# EAGLE design audio_proc (EAGLE 5.07)
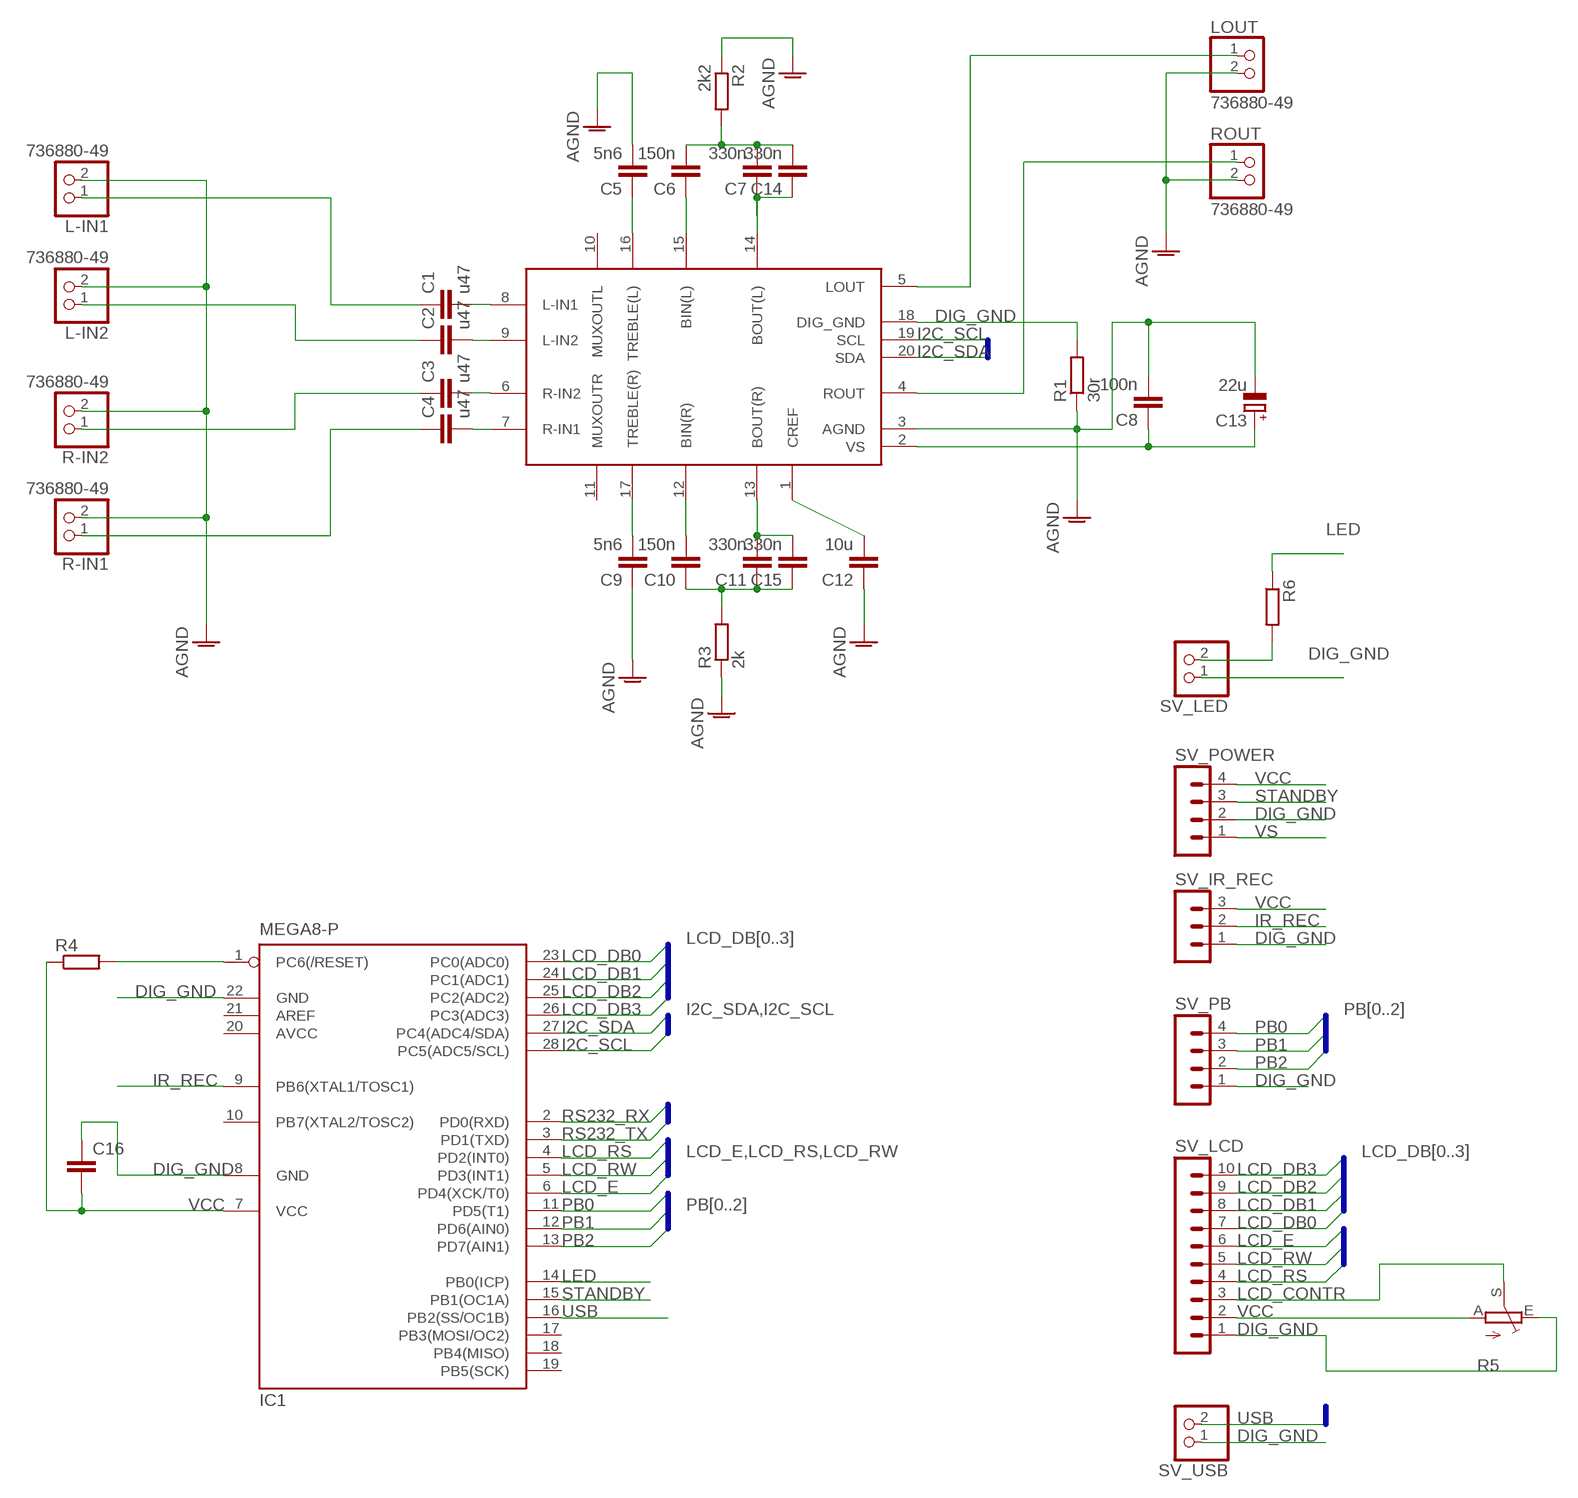
[diagram p0: schematic, sheet 1]

## Parts
C1  u47  C-EU050-030X075  [C050-030X075]
C2  u47  C-EU050-030X075  [C050-030X075]
C3  u47  C-EU050-030X075  [C050-030X075]
C4  u47  C-EU050-030X075  [C050-030X075]
C5  5n6  C-EU050-030X075  [C050-030X075]
C6  150n  C-EU050-030X075  [C050-030X075]
C7  330n  C-EU050-030X075  [C050-030X075]
C8  100n  C-EU025-025X050  [C025-025X050]
C9  5n6  C-EU050-030X075  [C050-030X075]
C10  150n  C-EU050-030X075  [C050-030X075]
C11  330n  C-EU050-030X075  [C050-030X075]
C12  10u  C-EU050-030X075  [C050-030X075]
C13  22u  CPOL-EUE2.5-6  [E2,5-6]
C14  330n  C-EU050-030X075  [C050-030X075]
C15  330n  C-EU050-030X075  [C050-030X075]
C16  C-EU025-024X044  [C025-024X044]
IC1  MEGA8-P  [DIL28-3]
L-IN1  736880-49  PINHD-1X2  [1X02]
L-IN2  736880-49  PINHD-1X2  [1X02]
LOUT  736880-49  PINHD-1X2  [1X02]
R1  30r  R-EU_0204/5  [0204/5]
R2  2k2  R-EU_0204/2V  [0204V]
R3  2k  R-EU_0204/2V  [0204V]
R4  R-EU_0204/2V  [0204V]
R5  TRIM_EU-S75P  [S75P]
R6  R-EU_0204/5  [0204/5]
R-IN1  736880-49  PINHD-1X2  [1X02]
R-IN2  736880-49  PINHD-1X2  [1X02]
ROUT  736880-49  PINHD-1X2  [1X02]
SV_IR_REC  MA03-1  [MA03-1]
SV_LCD  MA10-1  [MA10-1]
SV_LED  PINHD-1X2  [1X02]
SV_PB  MA04-1  [MA04-1]
SV_POWER  MA04-1  [MA04-1]
SV_USB  PINHD-1X2  [1X02]
U$1  TDA7449  [20DIP]

## Nets
AGND: C5.2 C8.2 C9.1 C12.1 C13.- L-IN1.2 L-IN2.2 LOUT.2 R1.1 R2.1 R3.1 R-IN1.2 R-IN2.2 ROUT.2 U$1.3(AGND)
DIG_GND: C16.1 IC1.8(GND) IC1.22(GND) R1.2 R5.E SV_IR_REC.1 SV_LCD.1 SV_LED.1 SV_PB.1 SV_POWER.2 SV_USB.1 U$1.18(DIG_GND)
I2C_SCL: IC1.28(PC5(ADC5/SCL)) U$1.19(SCL)
I2C_SDA: IC1.27(PC4(ADC4/SDA)) U$1.20(SDA)
IR_REC: IC1.9(PB6(XTAL1/TOSC1)) SV_IR_REC.2
LCD_CONTR: R5.S SV_LCD.3
LCD_DB0: IC1.23(PC0(ADC0)) SV_LCD.7
LCD_DB1: IC1.24(PC1(ADC1)) SV_LCD.8
LCD_DB2: IC1.25(PC2(ADC2)) SV_LCD.9
LCD_DB3: IC1.26(PC3(ADC3)) SV_LCD.10
LCD_E: IC1.6(PD4(XCK/T0)) SV_LCD.6
LCD_RS: IC1.4(PD2(INT0)) SV_LCD.4
LCD_RW: IC1.5(PD3(INT1)) SV_LCD.5
LED: IC1.14(PB0(ICP)) R6.1
LOUT: LOUT.1 U$1.5(LOUT)
N$1: C6.2 C7.2 C14.2 R2.2
N$2: C10.1 C11.1 C15.1 R3.2
N$3: C7.1 C14.1 U$1.14(BOUT(L))
N$4: C12.2 U$1.1(CREF)
N$5: C6.1 U$1.15(BIN(L))
N$6: C11.2 C15.2 U$1.13(BOUT(R))
N$7: C10.2 U$1.12(BIN(R))
N$8: IC1.1(PC6(/RESET)) R4.2
N$10: C9.2 U$1.17(TREBLE(R))
N$11: C5.1 U$1.16(TREBLE(L))
N$12: C1.2 U$1.8(L-IN1)
N$13: C2.2 U$1.9(L-IN2)
N$14: C3.2 U$1.6(R-IN2)
N$15: C4.2 U$1.7(R-IN1)
N$16: C1.1 L-IN1.1
N$17: C2.1 L-IN2.1
N$18: C3.1 R-IN2.1
N$19: C4.1 R-IN1.1
N$20: R6.2 SV_LED.2
PB0: IC1.11(PD5(T1)) SV_PB.4
PB1: IC1.12(PD6(AIN0)) SV_PB.3
PB2: IC1.13(PD7(AIN1)) SV_PB.2
ROUT: ROUT.1 U$1.4(ROUT)
RS232_RX: IC1.2(PD0(RXD))
RS232_TX: IC1.3(PD1(TXD))
STANDBY: IC1.15(PB1(OC1A)) SV_POWER.3
USB: IC1.16(PB2(SS/OC1B)) SV_USB.2
VCC: C16.2 IC1.7(VCC) R4.1 R5.A SV_IR_REC.3 SV_LCD.2 SV_POWER.4
VS: C8.1 C13.+ SV_POWER.1 U$1.2(VS)
Unconnected: IC1.10(PB7(XTAL2/TOSC2)) IC1.17(PB3(MOSI/OC2)) IC1.18(PB4(MISO)) IC1.19(PB5(SCK)) IC1.21(AREF) U$1.10(MUXOUTL) U$1.11(MUXOUTR)

## Buses
LCD_E,LCD_RS,LCD_RW
PB[0..2]
B$3
I2C_SDA,I2C_SCL
B$9
LCD_DB[0..3]

## Power pins joined to a net without a drawn wire
AVCC: IC1.20(AVCC)

## Library data of the parts
C1-C12 C14-C16 = resistor:C-EU: CAPACITOR, European symbol
C13 = resistor:CPOL-EU: POLARIZED CAPACITOR, European symbol
IC1 = atmel:MEGA8-P: MICROCONTROLLER 8 Kbytes FLASH, 1 kbytes SRAM, 512 bytes EEPROM, USART, 4-channel 10 bit ADC, 2-channel 8 bit ADC Pin compatible with Atmega48, ATMega88, ATMega168 Source: avr.lbr
L-IN1 L-IN2 LOUT R-IN1 R-IN2 ROUT SV_LED SV_USB = pinhead:PINHD-1X2: PIN HEADER
R1-R4 R6 = resistor:R-EU_: RESISTOR, European symbol
R5 = pot:TRIM_EU-: POTENTIOMETER
SV_IR_REC = con-lstb:MA03-1: PIN HEADER
SV_LCD = con-lstb:MA10-1: PIN HEADER
SV_PB SV_POWER = con-lstb:MA04-1: PIN HEADER
U$1 = national-semiconductor-lm4780TA:TDA7449: TDA7449 Audioprocessor Digital 20DIP

## Board
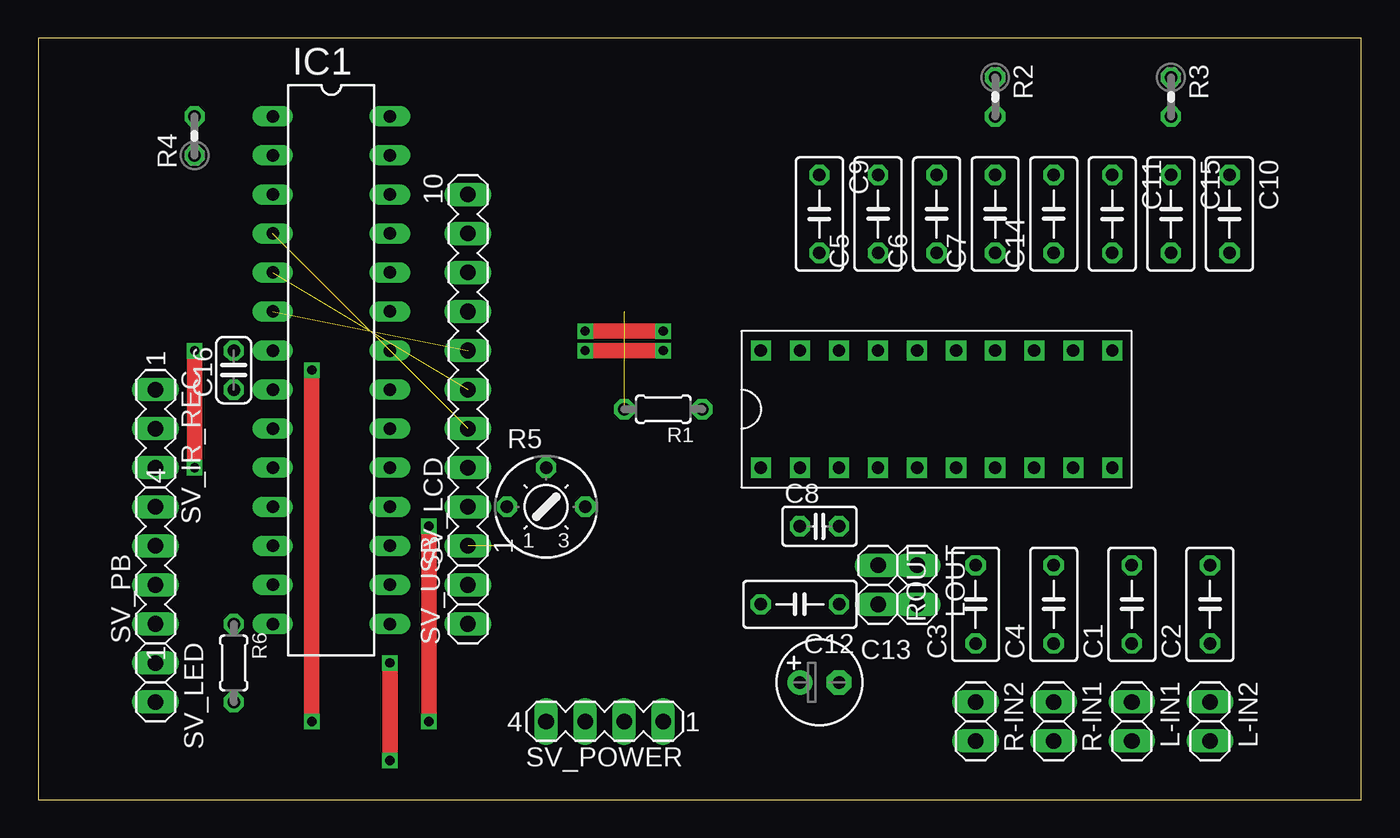
[diagram p1: board, top side]
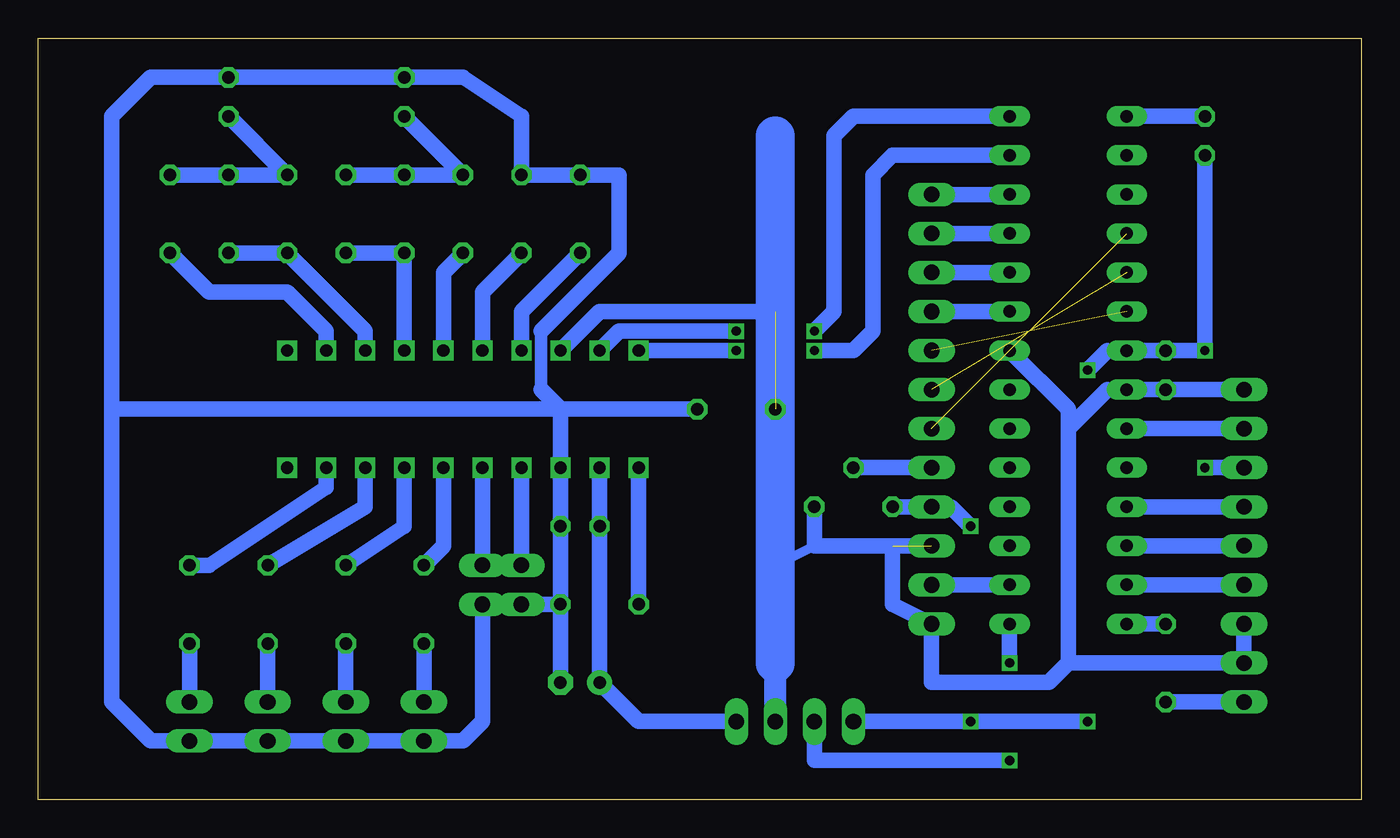
[diagram p2: board, bottom side, seen from below]

Size 86.03 x 49.52 mm. Coordinates in mm from the lower left corner, seen from the top.
Outline: 0,0 86.03,0 86.03,49.52 0,49.52 0,0
Copper layers (1*16): Top 0.035mm / dielectric 1.5mm / Bottom 0.035mm
Design rules "default": minimum track width 10mil, minimum drill 24mil, track to track 8mil, track to pad 8mil, pad to pad 8mil, via to via 8mil, smd to smd 8mil, copper to edge 40mil, drill to drill 8mil, minimum pad ring 10mil, minimum via ring 8mil, stop-mask expansion 4mil, vias tented up to drill 0mil, thermal gap 10mil

### Footprints (pad centres in the part's own frame; a part is rotated, then mirrored left to right if it is on the bottom)
C050-030X075 = drill 0.813 octagon: 1 -2.54,0; 2 2.54,0
C025-025X050 = drill 0.813 octagon: 1 -1.27,0; 2 1.27,0
E2,5-6 = drill 0.813 pad 1.6 round: + -1.27,0 | drill 0.813 pad 1.6 octagon: - 1.27,0
C025-024X044 = drill 0.813 octagon: 1 -1.27,0; 2 1.27,0
DIL28-3 = drill 0.813 long: 1 -16.51,-3.81; 2 -13.97,-3.81; 3 -11.43,-3.81; 4 -8.89,-3.81; 5 -6.35,-3.81; 6 -3.81,-3.81; 7 -1.27,-3.81; 8 1.27,-3.81; 9 3.81,-3.81; 10 6.35,-3.81; 11 8.89,-3.81; 12 11.43,-3.81; 13 13.97,-3.81; 14 16.51,-3.81; 15 16.51,3.81; 16 13.97,3.81; 17 11.43,3.81; 18 8.89,3.81; 19 6.35,3.81; 20 3.81,3.81; 21 1.27,3.81; 22 -1.27,3.81; 23 -3.81,3.81; 24 -6.35,3.81; 25 -8.89,3.81; 26 -11.43,3.81; 27 -13.97,3.81; 28 -16.51,3.81
1X02 = drill 1.016 long: 1 -1.27,0; 2 1.27,0
0204/5 = drill 0.813 octagon: 1 -2.54,0; 2 2.54,0
0204V = drill 0.813 octagon: 1 -1.27,0; 2 1.27,0
S75P = drill 0.813 octagon: A -2.54,0; E 2.54,0; S 0,2.54
MA03-1 = drill 1.016 long: 1 -2.54,0; 2 0,0; 3 2.54,0
MA10-1 = drill 1.016 long: 1 -11.43,0; 2 -8.89,0; 3 -6.35,0; 4 -3.81,0; 5 -1.27,0; 6 1.27,0; 7 3.81,0; 8 6.35,0; 9 8.89,0; 10 11.43,0
MA04-1 = drill 1.016 long: 1 -3.81,0; 2 -1.27,0; 3 1.27,0; 4 3.81,0
20DIP = drill 0.8 square: 1 0,0; 2 2.54,0; 3 5.08,0; 4 7.62,0; 5 10.16,0; 6 12.7,0; 7 15.24,0; 8 17.78,0; 9 20.32,0; 10 22.86,0; 11 22.86,7.62; 12 20.32,7.62; 13 17.78,7.62; 14 15.24,7.62; 15 12.7,7.62; 16 10.16,7.62; 17 7.62,7.62; 18 5.08,7.62; 19 2.54,7.62; 20 0,7.62

### Placement (x,y rotation side)
C1  71.12,12.7 90 top
C2  76.2,12.7 90 top
C3  60.96,12.7 90 top
C4  66.04,12.7 90 top
C5  54.61,38.1 90 top
C6  58.42,38.1 90 top
C7  62.23,38.1 90 top
C8  50.8,17.78 0 top
C9  50.8,38.1 270 top
C10  77.47,38.1 270 top
C11  69.85,38.1 270 top
C12  49.53,12.7 180 top
C13  50.8,7.62 0 top
C14  66.04,38.1 90 top
C15  73.66,38.1 270 top
C16  12.7,27.94 90 top
IC1  19.05,27.94 270 top
L-IN1  71.12,5.08 270 top
L-IN2  76.2,5.08 270 top
LOUT  57.15,13.97 270 top
R1  40.64,25.4 180 top
R2  62.23,45.72 270 top
R3  73.66,45.72 270 top
R4  10.16,43.18 90 top
R5  33.02,19.05 0 top
R6  12.7,8.89 270 top
R-IN1  66.04,5.08 270 top
R-IN2  60.96,5.08 270 top
ROUT  54.61,13.97 270 top
SV_IR_REC  7.62,24.13 270 top
SV_LCD  27.94,27.94 90 top
SV_LED  7.62,7.62 270 top
SV_PB  7.62,15.24 90 top
SV_POWER  36.83,5.08 180 top
SV_USB  27.94,12.7 90 top
U$1  46.99,21.59 0 top

### Tracks (layer width: path | path; a pad name or v marks a point on that pad's centre or on a via)
AGND
  Bottom 0.813: 53.34,26.67 53.34,30.48
  Bottom 1.016: 53.34,30.48 48.26,35.56 48.26,40.64 C9.1 C5.2 54.61,44.45 58.42,46.99 R2.1 R3.1 78.74,46.99 81.28,44.45 81.28,25.4 | 52.07,25.4 R1.1 | 52.07,25.4 53.34,26.67 | C12.1 C8.2 U$1.3 52.07,25.4 | C13.- C12.1 | 81.28,25.4 81.28,6.35 78.74,3.81 L-IN2.2 L-IN1.2 R-IN1.2 R-IN2.2 58.42,3.81 57.15,5.08 LOUT.2 ROUT.2 C12.1 | 52.07,25.4 81.28,25.4
DIG_GND  (2 unrouted)
  Bottom 0.61: 16.51,26.67 IC1.8 | 38.1,15.24 35.56,16.51
  Bottom 1.016: U$1.18 49.53,31.75 38.1,31.75 | R5.E 35.56,16.51 SV_LCD.1 | IC1.8 C16.1 SV_IR_REC.1 | SV_PB.1 SV_LED.1 19.05,8.89 | 19.05,8.89 19.05,24.13 | 19.05,24.13 16.51,26.67 | IC1.22 19.05,25.4 19.05,24.13 | 30.48,16.51 30.48,12.7 SV_USB.1 27.94,7.62 20.32,7.62 19.05,8.89
  Bottom 1.422: SV_POWER.2 38.1,8.89
  Bottom 2.54: 38.1,8.89 38.1,15.24 38.1,31.75 38.1,43.18
I2C_SCL  (via drill 0.6)
  Top 1.016: v35.56,30.48 v40.64,30.48
  Bottom 1.016: IC1.28 33.02,44.45 34.29,43.18 34.29,31.75 v35.56,30.48 | v40.64,30.48 48.26,30.48 U$1.19
I2C_SDA  (via drill 0.6)
  Top 1.016: v35.56,29.21 v40.64,29.21
  Bottom 1.016: IC1.27 30.48,41.91 31.75,40.64 31.75,30.48 33.02,29.21 v35.56,29.21 | v40.64,29.21 U$1.20
IR_REC
  Bottom 1.016: SV_IR_REC.2 IC1.9
LCD_CONTR
  Bottom 1.016: SV_LCD.3 R5.S
LCD_DB0
  Bottom 1.016: IC1.23 SV_LCD.7
LCD_DB1
  Bottom 1.016: IC1.24 SV_LCD.8
LCD_DB2
  Bottom 1.016: IC1.25 SV_LCD.9
LCD_DB3
  Bottom 1.016: IC1.26 SV_LCD.10
LCD_E  (1 unrouted)
LCD_RS  (1 unrouted)
LCD_RW  (1 unrouted)
LED
  Bottom 1.016: R6.1 IC1.14
LOUT
  Bottom 1.016: LOUT.1 U$1.5
N$1
  Bottom 1.016: R2.2 C6.2 C7.2 C14.2
N$2
  Bottom 1.016: R3.2 C11.1 C15.1 C10.1
N$3
  Bottom 1.016: C14.1 C7.1 U$1.14
N$4
  Bottom 1.016: C12.2 U$1.1
N$5
  Bottom 1.016: U$1.15 59.69,34.29 C6.1
N$6
  Bottom 1.016: C15.2 C11.2 64.77,30.48 U$1.13
N$7
  Bottom 1.016: U$1.12 67.31,30.48 69.85,33.02 74.93,33.02 C10.2
N$8
  Bottom 1.016: R4.2 IC1.1
N$10
  Bottom 1.016: U$1.17 54.61,31.75 C9.2
N$11
  Bottom 1.016: U$1.16 57.15,33.02 C5.1
N$12
  Bottom 1.016: U$1.8 64.77,19.05 C1.2
N$13
  Bottom 1.016: U$1.9 67.31,20.32 74.93,15.24 C2.2
N$14
  Bottom 1.016: U$1.6 59.69,16.51 C3.2
N$15
  Bottom 1.016: U$1.7 62.23,17.78 C4.2
N$16
  Bottom 1.016: L-IN1.1 C1.1
N$17
  Bottom 1.016: L-IN2.1 C2.1
N$18
  Bottom 1.016: R-IN2.1 C3.1
N$19
  Bottom 1.016: R-IN1.1 C4.1
N$20
  Bottom 1.016: SV_LED.2 R6.2
PB0
  Bottom 1.016: SV_PB.4 IC1.11
PB1
  Bottom 1.016: SV_PB.3 IC1.12
PB2
  Bottom 1.016: SV_PB.2 IC1.13
ROUT
  Bottom 1.016: ROUT.1 U$1.4
STANDBY  (via drill 0.6)
  Top 1.016: v22.86,2.54 v22.86,8.89
  Bottom 1.016: v22.86,8.89 IC1.15 | v22.86,2.54 35.56,2.54 SV_POWER.3
USB
  Bottom 1.016: IC1.16 SV_USB.2
VCC  (via drill 0.6)
  Top 1.016: v17.78,5.08 v17.78,27.94 | v25.4,5.08 v25.4,17.78 | v10.16,29.21 v10.16,21.59
  Bottom 0.61: 16.51,29.21 IC1.7
  Bottom 1.016: R5.A SV_LCD.2 26.67,19.05 v25.4,17.78 | IC1.7 C16.2 v10.16,29.21 R4.1 | v10.16,21.59 SV_IR_REC.3 | v17.78,27.94 16.51,29.21 | v17.78,5.08 v25.4,5.08 SV_POWER.4
VS
  Bottom 1.016: U$1.2 C8.1 C13.+ 46.99,5.08 SV_POWER.1